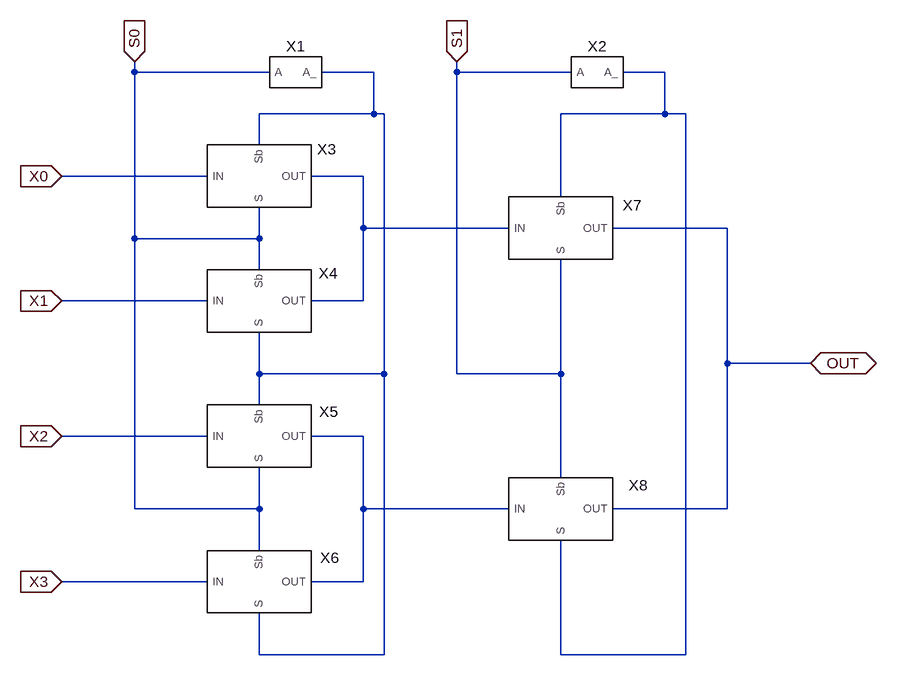
[diagram p0: schematic MUX.asc]
MUX.asc, the LTspice schematic file:
Version 4
SHEET 1 3824 852
WIRE 448 -112 448 -128
WIRE 656 -112 448 -112
WIRE 816 -112 736 -112
WIRE 944 -112 944 -128
WIRE 1120 -112 944 -112
WIRE 1264 -112 1200 -112
WIRE 816 -48 816 -112
WIRE 816 -48 640 -48
WIRE 832 -48 816 -48
WIRE 1264 -48 1264 -112
WIRE 1264 -48 1104 -48
WIRE 1296 -48 1264 -48
WIRE 640 0 640 -48
WIRE 560 48 336 48
WIRE 800 48 720 48
WIRE 1104 80 1104 -48
WIRE 800 128 800 48
WIRE 1024 128 800 128
WIRE 1360 128 1184 128
WIRE 448 144 448 -112
WIRE 640 144 640 96
WIRE 640 144 448 144
WIRE 640 192 640 144
WIRE 560 240 336 240
WIRE 800 240 800 128
WIRE 800 240 720 240
WIRE 1360 336 1360 128
WIRE 1488 336 1360 336
WIRE 640 352 640 288
WIRE 832 352 832 -48
WIRE 832 352 640 352
WIRE 944 352 944 -112
WIRE 1104 352 1104 176
WIRE 1104 352 944 352
WIRE 640 400 640 352
WIRE 560 448 336 448
WIRE 800 448 720 448
WIRE 1104 512 1104 352
WIRE 448 560 448 144
WIRE 640 560 640 496
WIRE 640 560 448 560
WIRE 800 560 800 448
WIRE 1024 560 800 560
WIRE 1360 560 1360 336
WIRE 1360 560 1184 560
WIRE 640 624 640 560
WIRE 560 672 336 672
WIRE 800 672 800 560
WIRE 800 672 720 672
WIRE 640 784 640 720
WIRE 832 784 832 352
WIRE 832 784 640 784
WIRE 1104 784 1104 608
WIRE 1296 784 1296 -48
WIRE 1296 784 1104 784
FLAG 448 -128 S0
IOPIN 448 -128 In
FLAG 944 -128 S1
IOPIN 944 -128 In
FLAG 336 48 X0
IOPIN 336 48 In
FLAG 336 240 X1
IOPIN 336 240 In
FLAG 336 448 X2
IOPIN 336 448 In
FLAG 336 672 X3
IOPIN 336 672 In
FLAG 1488 336 OUT
IOPIN 1488 336 BiDir
SYMBOL TG 640 48 R0
WINDOW 0 104 -26 Bottom 2
SYMATTR InstName X3
SYMBOL TG 640 240 R0
WINDOW 0 106 -27 Bottom 2
SYMATTR InstName X4
SYMBOL TG 640 448 R0
WINDOW 0 107 -22 Bottom 2
SYMATTR InstName X5
SYMBOL TG 640 672 R0
WINDOW 0 108 -21 Bottom 2
SYMATTR InstName X6
SYMBOL TG 1104 128 R0
WINDOW 0 110 -20 Bottom 2
SYMATTR InstName X7
SYMBOL TG 1104 560 R0
WINDOW 0 119 -21 Bottom 2
SYMATTR InstName X8
SYMBOL INVERT 688 -112 R0
SYMATTR InstName X1
SYMBOL INVERT 1152 -112 R0
SYMATTR InstName X2

The netlist it stands for:
* MUX.asc
XX3 S0 N001 X0 N003 TG  ; pins S Sb IN OUT
XX4 N001 S0 X1 N003 TG  ; pins S Sb IN OUT
XX5 S0 N001 X2 N004 TG  ; pins S Sb IN OUT
XX6 N001 S0 X3 N004 TG  ; pins S Sb IN OUT
XX7 S1 N002 N003 OUT TG  ; pins S Sb IN OUT
XX8 N002 S1 N004 OUT TG  ; pins S Sb IN OUT
XX1 S0 N001 INVERT  ; pins A A_
XX2 S1 N002 INVERT  ; pins A A_
.backanno
.end